# EAGLE design level_bjt (EAGLE 7.3.0)
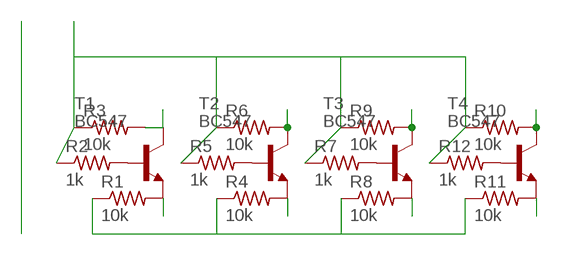
[diagram p0: schematic, sheet 1]

## Parts
R1  10k  R-US_0204/5  [0204/5]
R2  1k  R-US_0204/5  [0204/5]
R3  10k  R-US_0204/5  [0204/5]
R4  10k  R-US_0204/5  [0204/5]
R5  1k  R-US_0204/5  [0204/5]
R6  10k  R-US_0204/5  [0204/5]
R7  1k  R-US_0204/5  [0204/5]
R8  10k  R-US_0204/5  [0204/5]
R9  10k  R-US_0204/5  [0204/5]
R10  10k  R-US_0204/5  [0204/5]
R11  10k  R-US_0204/5  [0204/5]
R12  1k  R-US_0204/5  [0204/5]
T1  BC547  [TO92]
T2  BC547  [TO92]
T3  BC547  [TO92]
T4  BC547  [TO92]

## Nets
N$2: R2.2 T1.2(B)
N$3: R6.2 R9.2 R10.2 T2.3(C) T3.3(C) T4.3(C)
N$6: R5.2 T2.2(B)
N$7: R1.2 T1.1(E)
N$8: R7.2 T3.2(B)
N$9: R1.1 R4.1 R8.1 R11.1
N$10: R4.2 T2.1(E)
N$11: R8.2 T3.1(E)
N$12: R2.1 R3.1 R5.1 R6.1 R7.1 R9.1 R10.1 R12.1
N$13: R12.2 T4.2(B)
N$14: R11.2 T4.1(E)
N$19: R3.2 T1.3(C)

## Library data of the parts
R1-R12 = resistor:R-US_: RESISTOR, American symbol
T1-T4 = transistor:BC547: NPN TRANSISTOR

## Board
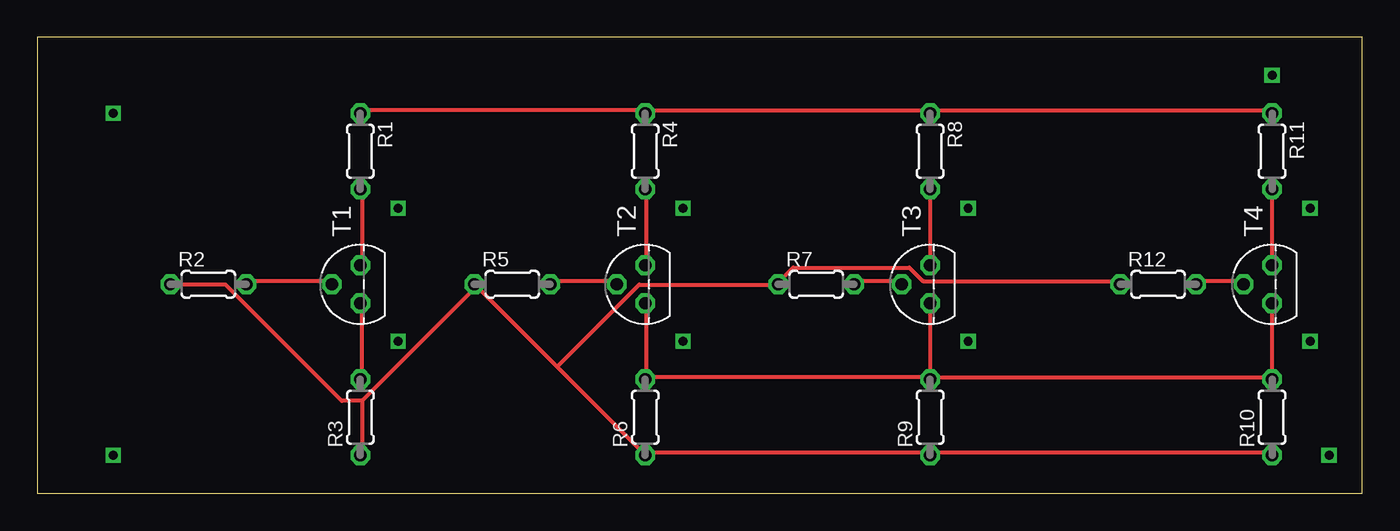
[diagram p1: board, top side]
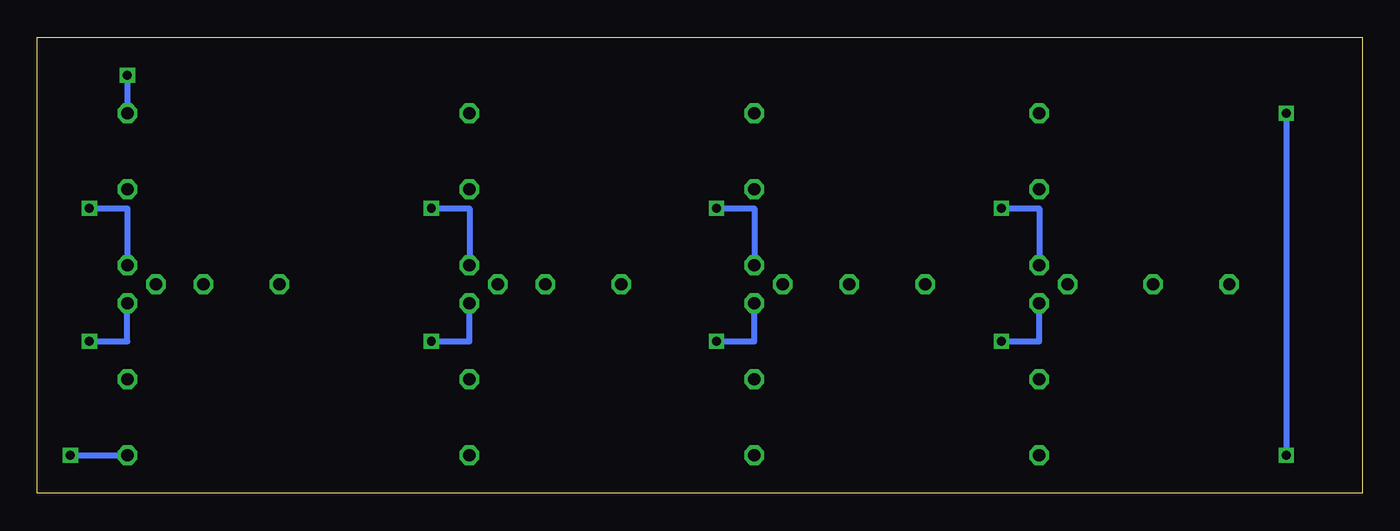
[diagram p2: board, bottom side, seen from below]

Size 88.57 x 30.47 mm. Coordinates in mm from the lower left corner, seen from the top.
Outline: 0,0 88.57,0 88.57,30.47 0,30.47 0,0
Copper layers (1*16): Top 0.035mm / dielectric 1.5mm / Bottom 0.035mm
Design rules "default": minimum track width 10mil, minimum drill 24mil, track to track 8mil, track to pad 8mil, pad to pad 8mil, via to via 8mil, smd to smd 8mil, copper to edge 40mil, drill to drill 8mil, minimum pad ring 10mil, minimum via ring 8mil, stop-mask expansion 4mil, vias tented up to drill 0mil, thermal gap 10mil

### Footprints (pad centres in the part's own frame; a part is rotated, then mirrored left to right if it is on the bottom)
0204/5 = drill 0.813 octagon: 1 -2.54,0; 2 2.54,0
TO92 = drill 0.813 octagon: 1 1.27,0; 2 0,1.905; 3 -1.27,0

### Placement (x,y rotation side)
R1  21.59,22.86 270 top
R2  11.43,13.97 0 top
R3  21.59,5.08 90 top
R4  40.64,22.86 270 top
R5  31.75,13.97 0 top
R6  40.64,5.08 90 top
R7  52.07,13.97 0 top
R8  59.69,22.86 270 top
R9  59.69,5.08 90 top
R10  82.55,5.08 90 top
R11  82.55,22.86 270 top
R12  74.93,13.97 0 top
T1  21.59,13.97 90 top
T2  40.64,13.97 90 top
T3  59.69,13.97 90 top
T4  82.55,13.97 90 top

### Tracks (layer width: path | path; a pad name or v marks a point on that pad's centre or on a via)
N$1  (via drill 0.6)
  Bottom 0.406: v5.08,25.4 v5.08,2.54
N$2
  Top 0.254: R2.2 14.17,14.17 19.66,14.17 T1.2
N$3  (via drill 0.6)
  Top 0.254: 82.53,7.77 82.53,12.57 T4.3 | 40.69,7.77 40.69,12.57 T2.3 | 59.66,7.77 59.66,12.57 T3.3 | 59.66,7.77 40.69,7.77 | 40.69,7.77 R6.2 | 59.66,7.77 R9.2 59.89,7.77 82.53,7.77 | 82.53,7.77 R10.2
  Bottom 0.406: v43.18,10.16 40.64,10.16 T2.3 | v62.23,10.16 59.69,10.16 T3.3 | v85.09,10.16 82.55,10.16 T4.3
N$6
  Top 0.254: R5.2 34.29,14.17 38.63,14.17 T2.2
N$7  (via drill 0.6)
  Top 0.254: T1.1 21.72,15.32 21.72,20.12 R1.2
  Bottom 0.406: v24.13,19.05 21.59,19.05 T1.1
N$8
  Top 0.254: R7.2 54.63,14.17 57.61,14.17 T3.2
N$9  (via drill 0.6)
  Top 0.254: R1.1 21.72,25.6 40.46,25.6 R4.1 40.69,25.6 59.66,25.6 R8.1 59.89,25.6 82.53,25.6 R11.1
  Bottom 0.406: v82.55,27.94 R11.1
N$10  (via drill 0.6)
  Top 0.254: T2.1 40.69,15.32 40.69,20.12 R4.2
  Bottom 0.406: v43.18,19.05 40.64,19.05 T2.1
N$11  (via drill 0.6)
  Top 0.254: T3.1 59.66,15.32 59.66,20.12 R8.2
  Bottom 0.406: v62.23,19.05 59.69,19.05 T3.1
N$12  (via drill 0.6)
  Top 0.254: 21.72,6.17 21.72,2.74 R3.1 | 21.72,6.17 29.03,13.49 29.03,13.95 R5.1 29.26,13.95 34.75,8.46 | 21.72,6.17 20.34,6.17 12.57,13.95 8.91,13.95 R2.1 | 34.75,8.46 40.46,2.74 R6.1 40.69,2.74 59.66,2.74 R9.1 59.89,2.74 82.53,2.74 R10.1 | 34.75,8.46 40.23,13.95 49.38,13.95 R7.1 49.61,14.17 50.52,15.09 58.29,15.09 59.21,14.17 72.24,14.17 R12.1
  Bottom 0.406: v86.36,2.54 R10.1
N$13
  Top 0.254: R12.2 77.5,14.17 80.47,14.17 T4.2
N$14  (via drill 0.6)
  Top 0.254: T4.1 82.53,15.32 82.53,20.12 R11.2
  Bottom 0.406: v85.09,19.05 82.55,19.05 T4.1
N$19  (via drill 0.6)
  Top 0.254: R3.2 21.72,7.77 21.72,12.57 T1.3
  Bottom 0.406: v24.13,10.16 21.59,10.16 T1.3